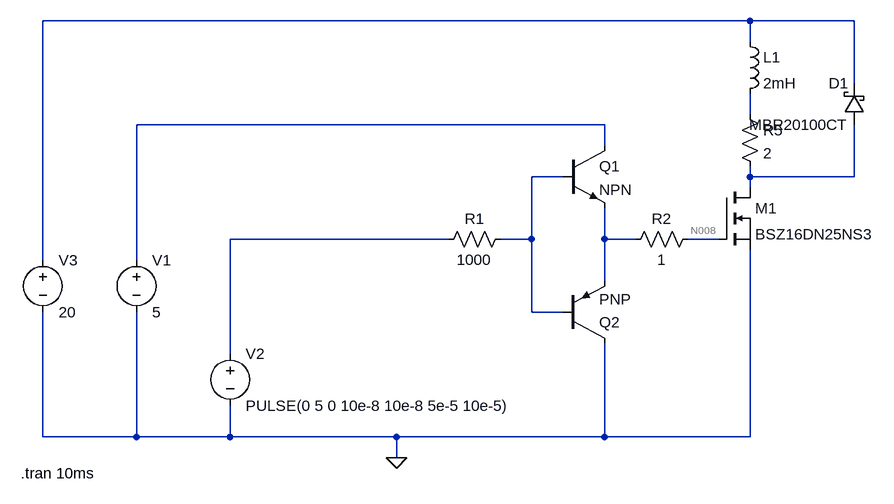
[diagram p0: schematic OpenCollectorDriver.asc]
OpenCollectorDriver.asc, the LTspice schematic file:
Version 4
SHEET 1 880 680
WIRE 288 -176 -800 -176
WIRE 448 -176 288 -176
WIRE 288 -144 288 -176
WIRE 448 -80 448 -176
WIRE 288 -32 288 -64
WIRE 64 -16 -656 -16
WIRE 64 16 64 -16
WIRE 0 64 -48 64
WIRE 288 64 288 48
WIRE 448 64 448 -16
WIRE 448 64 288 64
WIRE 288 80 288 64
WIRE -176 160 -512 160
WIRE -48 160 -48 64
WIRE -48 160 -96 160
WIRE 64 160 64 112
WIRE 112 160 64 160
WIRE 240 160 192 160
WIRE -800 192 -800 -176
WIRE -656 192 -656 -16
WIRE 64 224 64 160
WIRE -48 272 -48 160
WIRE 0 272 -48 272
WIRE -512 336 -512 160
WIRE -800 464 -800 272
WIRE -656 464 -656 272
WIRE -656 464 -800 464
WIRE -512 464 -512 416
WIRE -512 464 -656 464
WIRE -256 464 -512 464
WIRE 64 464 64 320
WIRE 64 464 -256 464
WIRE 288 464 288 176
WIRE 288 464 64 464
WIRE -256 496 -256 464
FLAG -256 496 0
SYMBOL voltage -512 320 R0
WINDOW 123 0 0 Left 0
WINDOW 39 0 0 Left 0
SYMATTR InstName V2
SYMATTR Value PULSE(0 5 0 10e-8 10e-8 5e-5 10e-5)
SYMBOL nmos 240 80 R0
SYMATTR InstName M1
SYMATTR Value BSZ16DN25NS3
SYMBOL voltage -800 176 R0
WINDOW 123 0 0 Left 0
WINDOW 39 0 0 Left 0
SYMATTR InstName V3
SYMATTR Value 20
SYMBOL res 272 -48 R0
SYMATTR InstName R5
SYMATTR Value 2
SYMBOL ind 272 -160 R0
SYMATTR InstName L1
SYMATTR Value 2mH
SYMBOL schottky 464 -16 R180
WINDOW 0 24 64 Left 2
WINDOW 3 24 0 Left 2
SYMATTR InstName D1
SYMATTR Value MBR20100CT
SYMATTR Description Diode
SYMATTR Type diode
SYMBOL voltage -656 176 R0
WINDOW 123 0 0 Left 0
WINDOW 39 0 0 Left 0
SYMATTR InstName V1
SYMATTR Value 5
SYMBOL res -80 144 R90
WINDOW 0 0 56 VBottom 2
WINDOW 3 32 56 VTop 2
SYMATTR InstName R1
SYMATTR Value 1000
SYMBOL res 208 144 R90
WINDOW 0 0 56 VBottom 2
WINDOW 3 32 56 VTop 2
SYMATTR InstName R2
SYMATTR Value 1
SYMBOL npn 0 16 R0
SYMATTR InstName Q1
SYMBOL pnp 0 320 M180
SYMATTR InstName Q2
TEXT -834 520 Left 2 !.tran 10ms

The netlist it stands for:
* OpenCollectorDriver.asc
V2 N006 0 PULSE(0 5 0 10e-8 10e-8 5e-5 10e-5)
M1 N005 N008 0 0 BSZ16DN25NS3
V3 N001 0 20
R5 N002 N005 2
L1 N001 N002 2mH
D1 N005 N001 MBR20100CT
V1 N003 0 5
R1 N004 N006 1000
R2 N008 N007 1
Q1 N003 N004 N007 0 NPN
Q2 0 N004 N007 0 PNP
.model D D
.lib standard.dio
.model NPN NPN
.model PNP PNP
.lib standard.bjt
.model NMOS NMOS
.model PMOS PMOS
.lib standard.mos
.tran 10ms
.backanno
.end

* Results of the author's LTspice run, read from the files saved beside the schematic
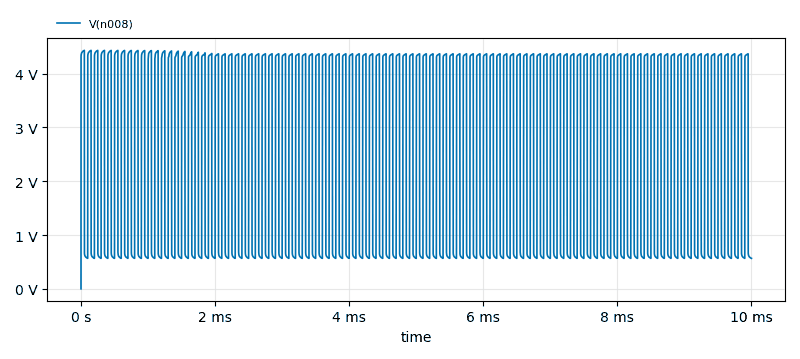
[diagram p1: Transient Analysis of OpenCollectorDriver.asc, plotted from the saved traces]
* Transient Analysis, 1 run:
*   V(n008): min 49.82 µV, max 4.434 V, average 2.478 V, rms 3.111 V, last 566.1 mV